# Altium schematic sheet Schematic_MicroBot Control Board V1.schdoc
size 262 x 194 mm
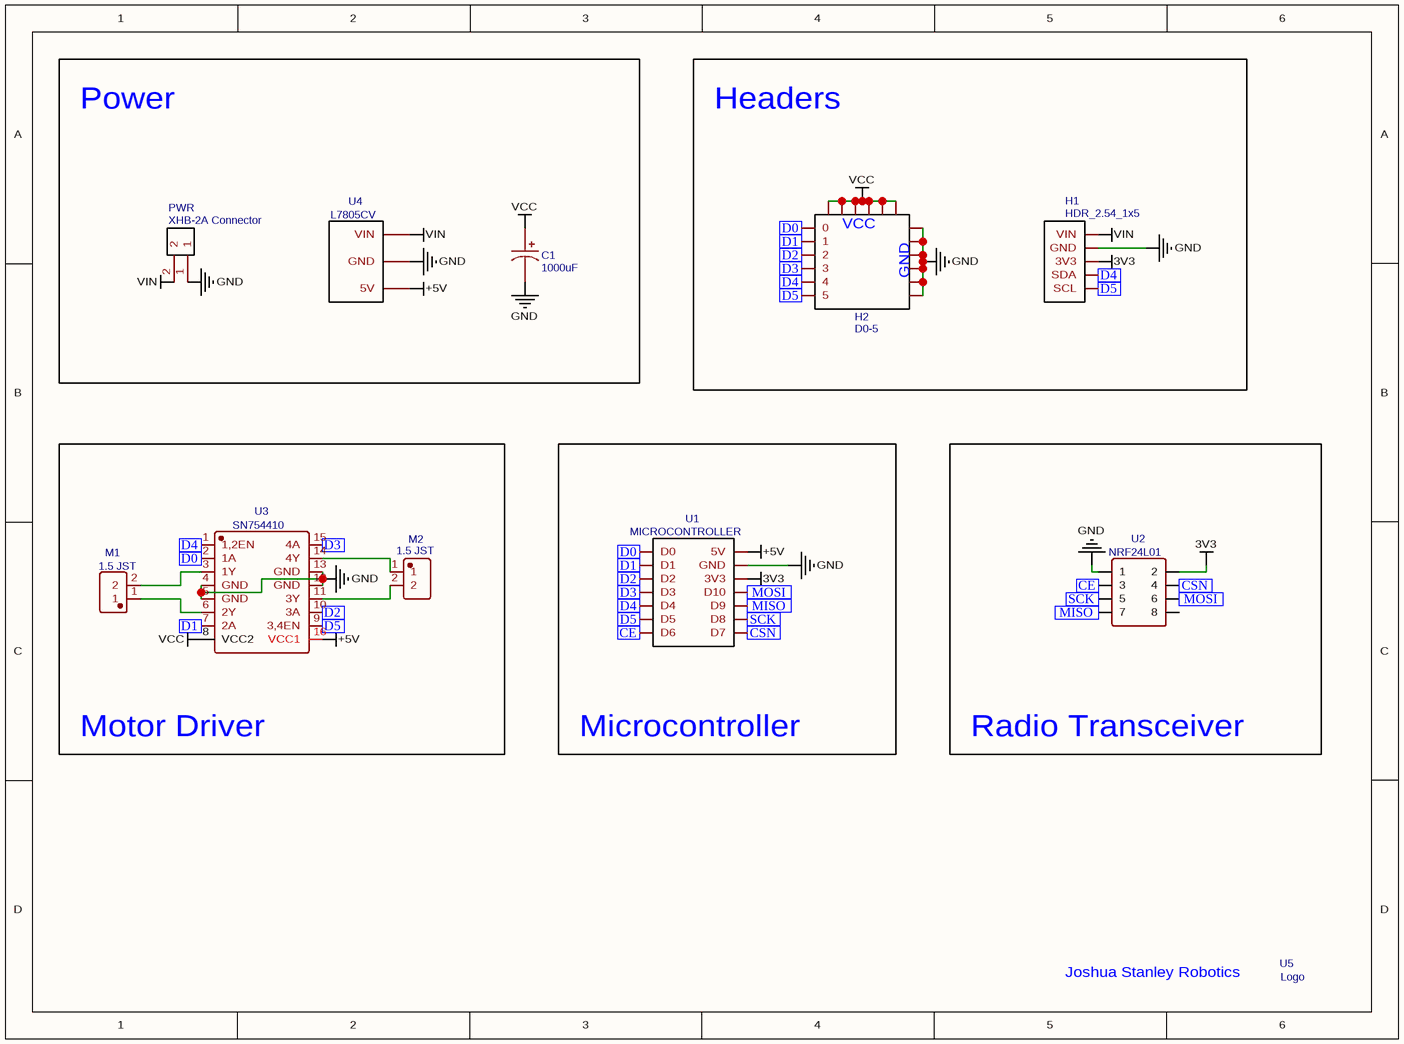
[diagram p0: Schematic_MicroBot Control Board V1.schdoc]

## Parts
C1  1000uF  [CAP-TH_BD8.0-P3.50-D0.6-FD-2]
H1  HDR_2.54_1x5  [HDR_2.54_1X5]
H2  D0-5  [HDR_2.54_3X6]
M1  1.5 JST  [CONN-TH_2P-P1.50_JST_B2B-ZR-K]
M2  1.5 JST  [CONN-TH_2P-P1.50_JST_B2B-ZR-K]
PWR  XHB-2A Connector  [CONN-TH_XHB-2A]
U1  MICROCONTROLLER  [SEEED XIAO]
U2  NRF24L01  [HDR-F-2.54_2X4]
U3  SN754410  [PDIP-16_L19.3-W6.4-P2.54-LS7.94-BL]
U4  L7805CV  [L7805]
U5  Logo  [LOGO]

## Blocks framed on the sheet
Power: C1 PWR U4
Headers: H1 H2
Motor Driver: M1 M2 U3
Microcontroller: U1
Radio Transceiver: U2

## Ports
CE (in), CSN (in), D0 (in), D1 (in), D2 (in), D3 (in), D4 (in), D5 (in), MISO (in), MOSI (in), SCK (in)

## Nets
3V3: H1.3(3V3) U1.11(3V3) U2.2
+5V: U1.13(5V) U3.16(VCC1) U4.3(5V)
GND: C1.2 H1.2(GND) H2.13 H2.14 H2.15 H2.16 H2.17 H2.18 PWR.1 U1.12(GND) U2.1 U3.4(GND) U3.5(GND) U3.12(GND) U3.13(GND) U4.2(GND)
VCC: C1.1 H2.7 H2.8 H2.9 H2.10 H2.11 H2.12 U3.8(VCC2)
VIN: H1.1(VIN) PWR.2 U4.1(VIN)
CE: U1.6(D6) U2.3 ; port CE
CSN: U1.7(D7) U2.4 ; port CSN
D0: H2.1(0) U1.0(D0) U3.2(1A) ; port D0
D1: H2.2(1) U1.1(D1) U3.7(2A) ; port D1
D2: H2.3(2) U1.2(D2) U3.10(3A) ; port D2
D3: H2.4(3) U1.3(D3) U3.15(4A) ; port D3
D4: H1.4(SDA) H2.5(4) U1.4(D4) U3.1(1,2EN) ; port D4
D5: H1.5(SCL) H2.6(5) U1.5(D5) U3.9(3,4EN) ; port D5
MISO: U1.9(D9) U2.7 ; port MISO
MOSI: U1.10(D10) U2.6 ; port MOSI
SCK: U1.8(D8) U2.5 ; port SCK
NetM1_1: M1.1 U3.6(2Y)
NetM1_2: M1.2 U3.3(1Y)
NetM2_1: M2.1 U3.14(4Y)
NetM2_2: M2.2 U3.11(3Y)

Not connected (* = marked no-connect by the designer): U2 8

## Notes on the sheet
- (in symbol D0-5) VCC; GND
- (in symbol Logo) Joshua Stanley Robotics

## Library data of the parts
C1 = 1000uF: Manufacturer: rubycon(红宝石); Manufacturer Part: 6.3YXJ1000M8X11.5; Contributor: lcsc; nameAlias: Value; Supplier: LCSC; Supplier Part: C694350; JLCPCB Part Class: Extended Part; spicePre: U; spiceSymbolName: 6.3YXJ1000M8X11.5
H1 = HDR_2.54_1x5: Contributor: jstan3546; spicePre: U; spiceSymbolName: HDR_2.54_1x5
H2 = D0-5: Contributor: jstan3546; spicePre: U; spiceSymbolName: HDR_2.54_3x6
M1 M2 = 1.5 JST: Manufacturer Part: B2B-ZR-K(LF)(SN); Contributor: lcsc; Supplier: LCSC; Supplier Part: C565960; Manufacturer: JST; JLCPCB Part Class: Extended Part; spicePre: C; spiceSymbolName: B2B-ZR-K(LF)(SN)
PWR = XHB-2A Connector: Manufacturer: BOOMELE(博穆精密); Supplier: LCSC; Manufacturer Part: XHB-2A; Supplier Part: C57981; JLCPCB Part Class: Extended Part; spicePre: C; spiceSymbolName: XHB-2A Connector
U1 = MICROCONTROLLER: Contributor: jstan3546; spicePre: U; spiceSymbolName: Seeed XIAO
U2 = NRF24L01: Contributor: LCEDA_Lib; Supplier Part: C239344; Supplier: LCSC; spicePre: H; spiceSymbolName: HDR-F-2.54_2x4
U3 = SN754410: Manufacturer: onsemi(安森美); Manufacturer Part: 74F253PC; Contributor: lcsc; Supplier: LCSC; Supplier Part: C3231508; spicePre: U; spiceSymbolName: 74F253PC
U4 = L7805CV: Contributor: jstan3546; spicePre: U; spiceSymbolName: L7805
U5 = Logo: Contributor: jstan3546; spicePre: U; spiceSymbolName: Logo